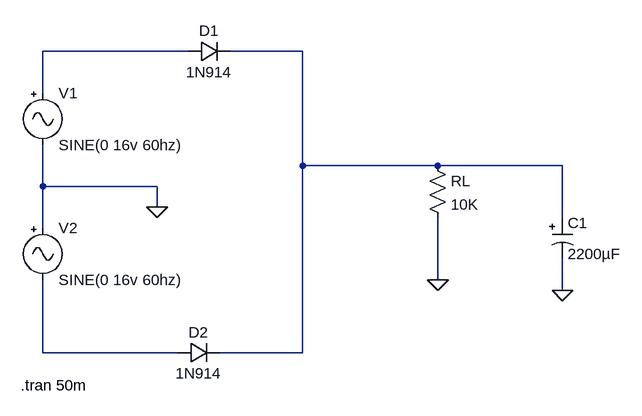
[diagram p0: schematic 2.2.2.asc]
2.2.2.asc, the LTspice schematic file:
Version 4
SHEET 1 948 680
WIRE 272 -16 48 -16
WIRE 448 -16 336 -16
WIRE 48 48 48 -16
WIRE 448 160 448 -16
WIRE 656 160 448 160
WIRE 848 160 656 160
WIRE 48 192 48 128
WIRE 224 192 48 192
WIRE 224 224 224 192
WIRE 848 240 848 160
WIRE 48 256 48 192
WIRE 656 336 656 240
WIRE 848 352 848 304
WIRE 48 448 48 336
WIRE 256 448 48 448
WIRE 448 448 448 160
WIRE 448 448 320 448
FLAG 224 224 0
FLAG 656 336 0
FLAG 848 352 0
SYMBOL Misc\\signal 48 32 R0
SYMATTR InstName V1
SYMATTR Value SINE(0 16v 60hz)
SYMBOL Misc\\signal 48 240 R0
SYMATTR InstName V2
SYMATTR Value SINE(0 16v 60hz)
SYMBOL diode 272 0 R270
WINDOW 0 32 32 VTop 2
WINDOW 3 0 32 VBottom 2
SYMATTR InstName D1
SYMATTR Value 1N914
SYMBOL diode 256 464 R270
WINDOW 0 32 32 VTop 2
WINDOW 3 0 32 VBottom 2
SYMATTR InstName D2
SYMATTR Value 1N914
SYMBOL res 640 144 R0
SYMATTR InstName RL
SYMATTR Value 10K
SYMBOL polcap 832 240 R0
SYMATTR InstName C1
SYMATTR Value 2200µF
TEXT 14 498 Left 2 !.tran 50m

The netlist it stands for:
* 2.2.2.asc
V1 N001 0 SINE(0 16v 60hz)
V2 0 N003 SINE(0 16v 60hz)
D1 N001 N002 1N914
D2 N003 N002 1N914
RL N002 0 10K
C1 N002 0 2200µF
.model D D
.lib standard.dio
.tran 50m
.backanno
.end